# Altium schematic sheet BPC_PWR_TOP.schdoc: Eurocard VME 6U (9.187 x 6.299 inches)
size A4; Organization: Organization; Address1: Address1; Address2: Address2; Address3: Address3; Address4: Address4; DocumentNumber: 1; Revision: 0; SheetNumber: 1; SheetTotal: 5
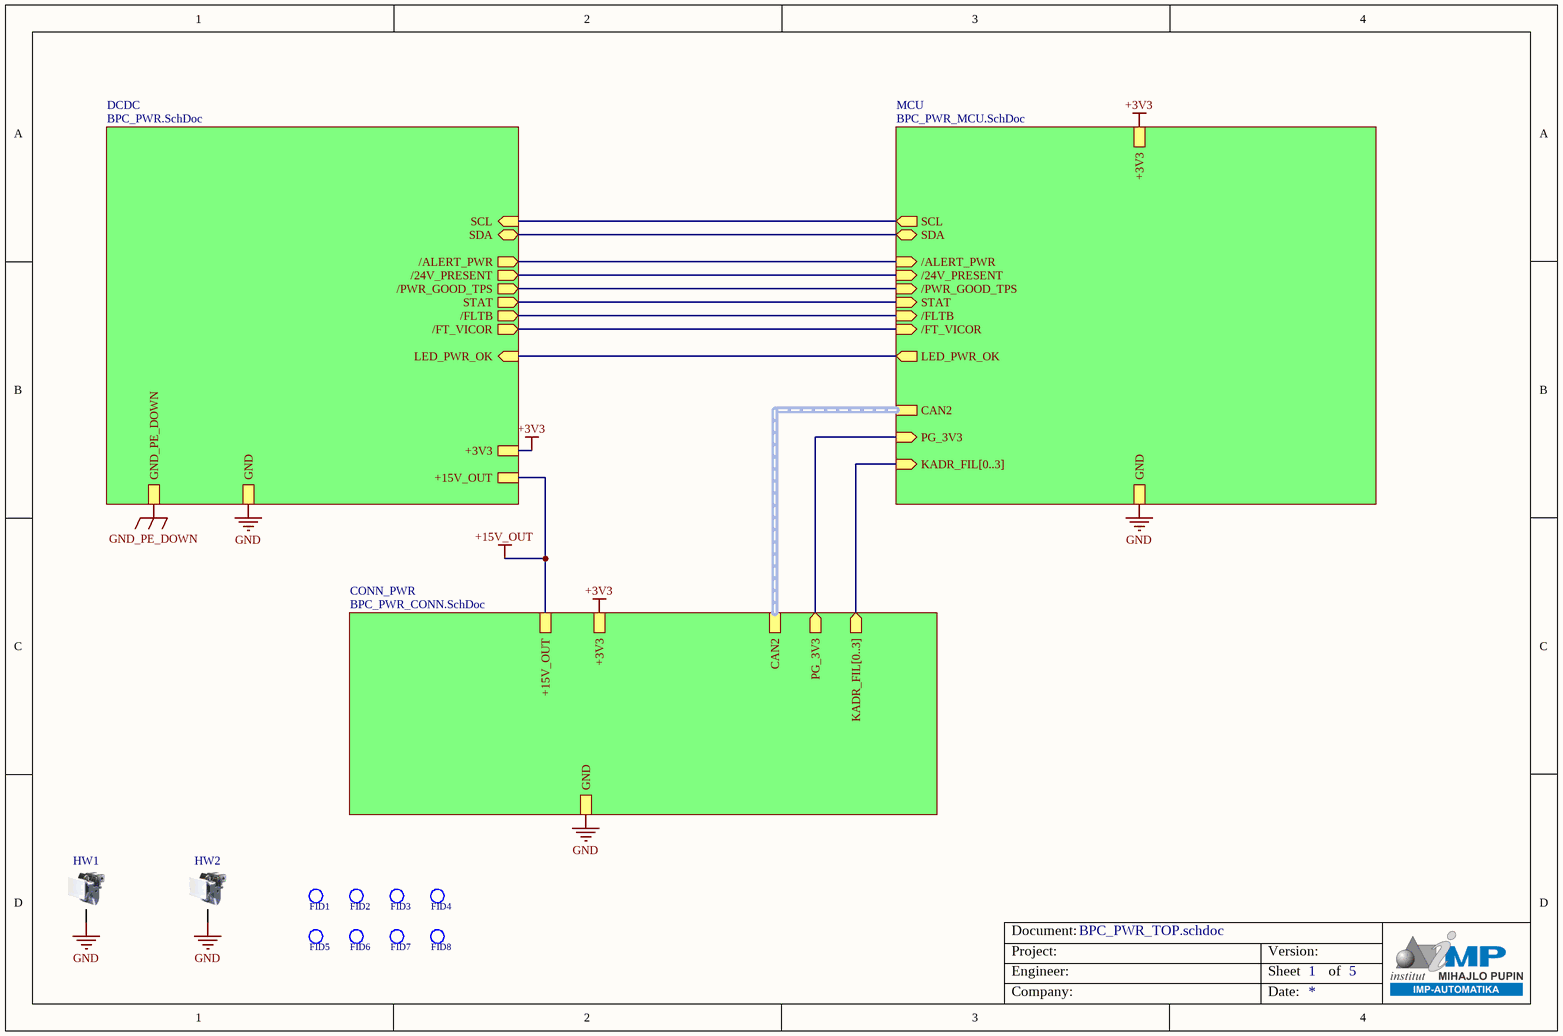
[diagram p0: BPC_PWR_TOP.schdoc]

## Parts
FID1  Fiducial Mark Round 1.6mm  [FIDUCIAL_3.2_1.6]  (value not drawn)  (no BOM)
FID2  Fiducial Mark Round 1.6mm  [FIDUCIAL_3.2_1.6]  (value not drawn)  (no BOM)
FID3  Fiducial Mark Round 1.6mm  [FIDUCIAL_3.2_1.6]  (value not drawn)  (no BOM)
FID4  Fiducial Mark Round 1.6mm  [FIDUCIAL_3.2_1.6]  (value not drawn)  (no BOM)
FID5  Fiducial Mark Round 1.6mm  [FIDUCIAL_3.2_1.6]  (value not drawn)  (no BOM)
FID6  Fiducial Mark Round 1.6mm  [FIDUCIAL_3.2_1.6]  (value not drawn)  (no BOM)
FID7  Fiducial Mark Round 1.6mm  [FIDUCIAL_3.2_1.6]  (value not drawn)  (no BOM)
FID8  Fiducial Mark Round 1.6mm  [FIDUCIAL_3.2_1.6]  (value not drawn)  (no BOM)
HW1  Extractor Handle  [Extractor Handle 3685.587 - Lower MS]  (value not drawn)
HW2  Extractor Handle  [Extractor Handle 3685.587 - Upper MS]  (value not drawn)

## Sub-sheets
CONN_PWR = BPC_PWR_CONN.SchDoc: +3V3, +15V_OUT, GND, KADR_FIL[0..3] (out), CAN2 (harness CAN2), PG_3V3 (out)
DCDC = BPC_PWR.SchDoc: /24V_PRESENT (out), /FLTB (out), GND_PE_DOWN, GND, +15V_OUT, +3V3, /FT_VICOR (out), STAT (out), /PWR_GOOD_TPS (out), /ALERT_PWR (out), SCL (in), SDA (bidir), LED_PWR_OK (in)
MCU = BPC_PWR_MCU.SchDoc: /24V_PRESENT (in), /PWR_GOOD_TPS (in), SCL (out), GND, /FT_VICOR (in), /FLTB (in), STAT (in), +3V3, SDA (bidir), /ALERT_PWR (in), KADR_FIL[0..3] (in), CAN2 (harness CAN2), PG_3V3 (in), LED_PWR_OK (out)

## Nets
+3V3: sheet MCU/+3V3, sheet DCDC/+3V3, sheet CONN_PWR/+3V3
+15V_OUT: sheet DCDC/+15V_OUT, sheet CONN_PWR/+15V_OUT
GND: HW1.0 HW2.0 ; sheet MCU/GND, sheet DCDC/GND, sheet CONN_PWR/GND
GND_PE_DOWN: sheet DCDC/GND_PE_DOWN
(unnamed): sheet MCU//24V_PRESENT, sheet DCDC//24V_PRESENT
(unnamed): sheet MCU//PWR_GOOD_TPS, sheet DCDC//PWR_GOOD_TPS
(unnamed): sheet MCU/SCL, sheet DCDC/SCL
(unnamed): sheet MCU//FT_VICOR, sheet DCDC//FT_VICOR
(unnamed): sheet MCU//FLTB, sheet DCDC//FLTB
(unnamed): sheet MCU/STAT, sheet DCDC/STAT
(unnamed): sheet MCU/SDA, sheet DCDC/SDA
(unnamed): sheet MCU//ALERT_PWR, sheet DCDC//ALERT_PWR
(unnamed): sheet MCU/PG_3V3, sheet CONN_PWR/PG_3V3
(unnamed): sheet MCU/LED_PWR_OK, sheet DCDC/LED_PWR_OK

## Buses and harness runs
bus sheet CONN_PWR/KADR_FIL[0..3] = sheet MCU/KADR_FIL[0..3]
harness sheet CONN_PWR/CAN2 = sheet MCU/CAN2

## Notes on the sheet
- Project:
- Document:
- Engineer:
- Version:
- Sheet
- of
- Company:
- Date:

## Library data of the parts
FID1-FID8 = Fiducial 1.6mm Round MS: Mounting: N/A; Package: N/A; Last Revision Date: 27.11.2020.
HW1 HW2 = HW Extractor Handle Type I 15mm 3685.587: Manufacturer: Wakefield-Vette; Distributor: Digi-Key; Distributor Part Number: 345-1342-ND; Manufacturer Part Number: 3685.587; Last Revision Date: 18.10.2020.; Temperature Range: N/A; Mounting: N/A; ComponentLink1Description: Datasheet; ComponentLink1URL: http://www.wakefield-vette.com/Portals/0/EPS%20data%20sheets/Components/Front%20Panels/extractor%20handle%20type%20I%20and%20II.pdf; ComponentLink2Description: Distributor; ComponentLink2URL: https://www.digikey.com/en/products/detail/wakefield-vette/3685587/5432427?s=N4IgTCBcDaIMwDYAcBWAdCpB2EBdAvkA; ComponentLink3Description: Manufacturer; ComponentLink3URL: http://www.wakefield-vette.com/products/electronic-packaging-systems/eps-components-accessories/front-panels-handles/extractors-ejectors-micro-switches/extractor-handle-type-i-and-type-ii.aspx; Status: Checked